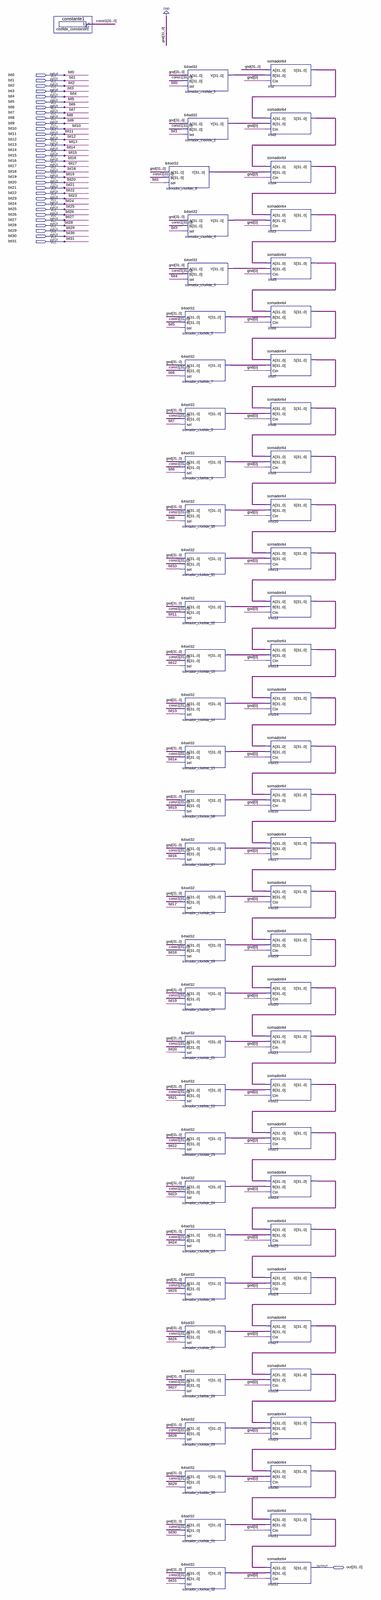
[diagram p0: schematic sheet, whole]
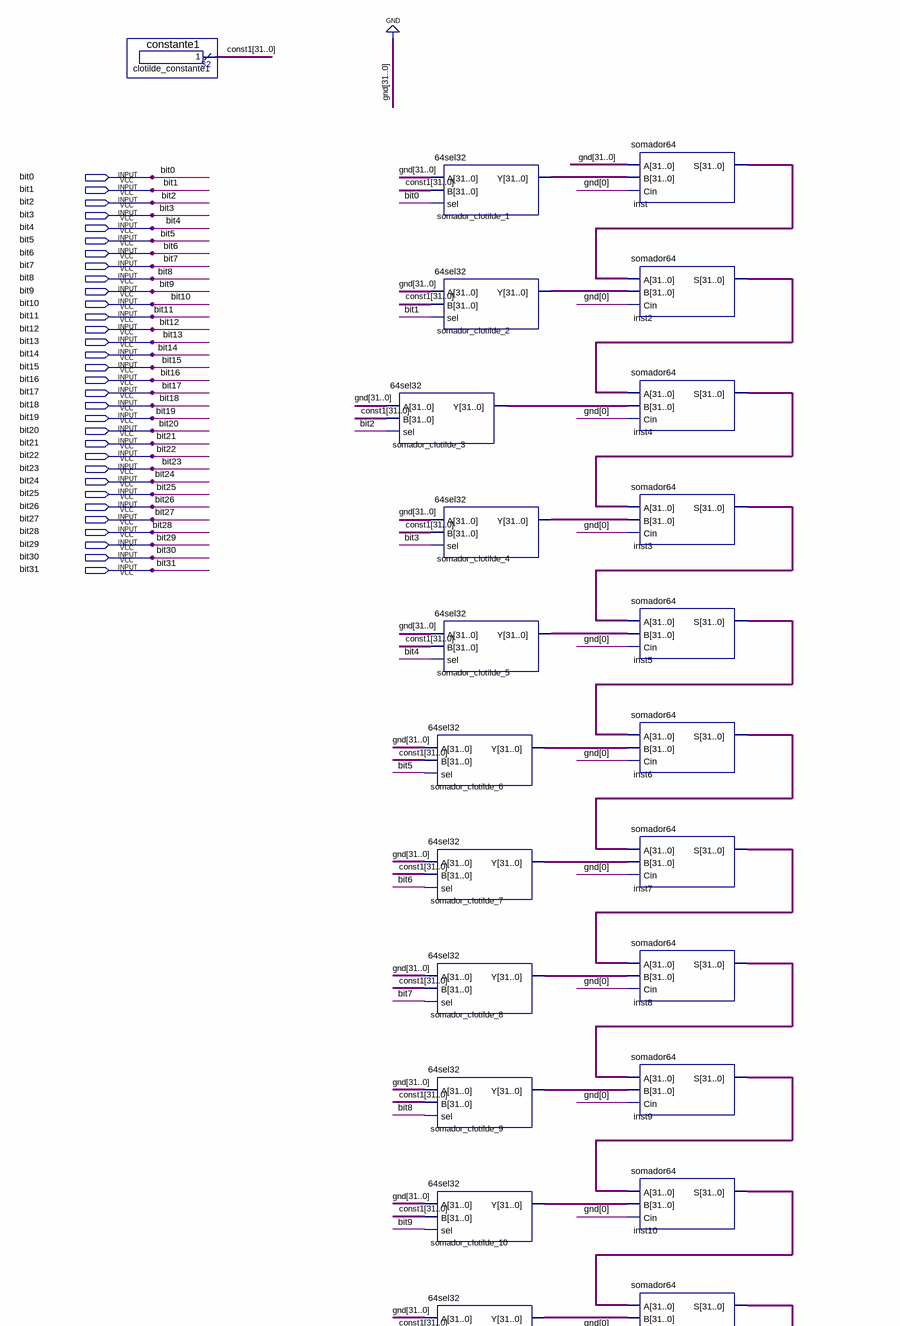
[diagram p1: schematic sheet, upper part]
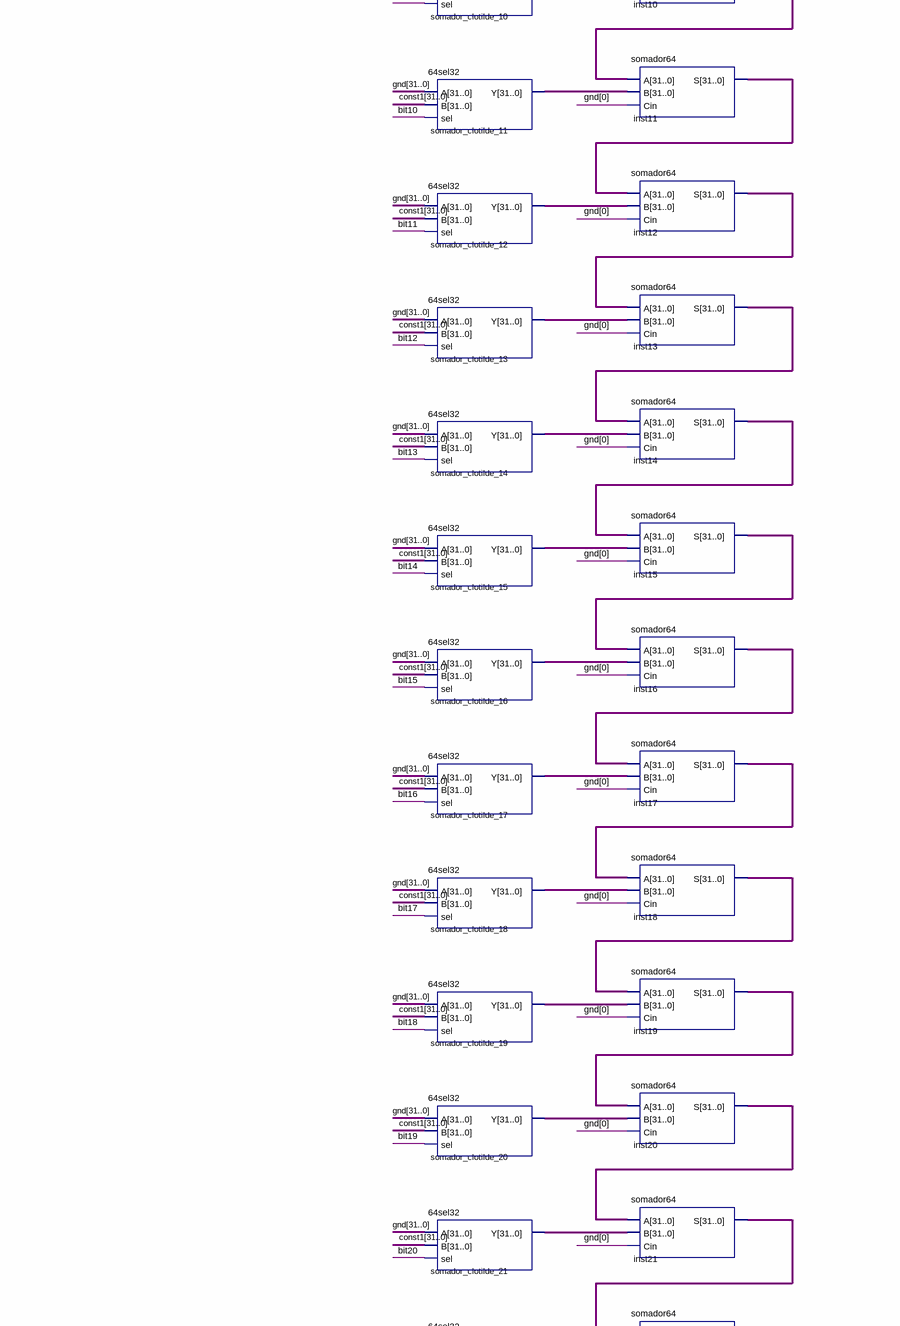
[diagram p2: schematic sheet, middle part]
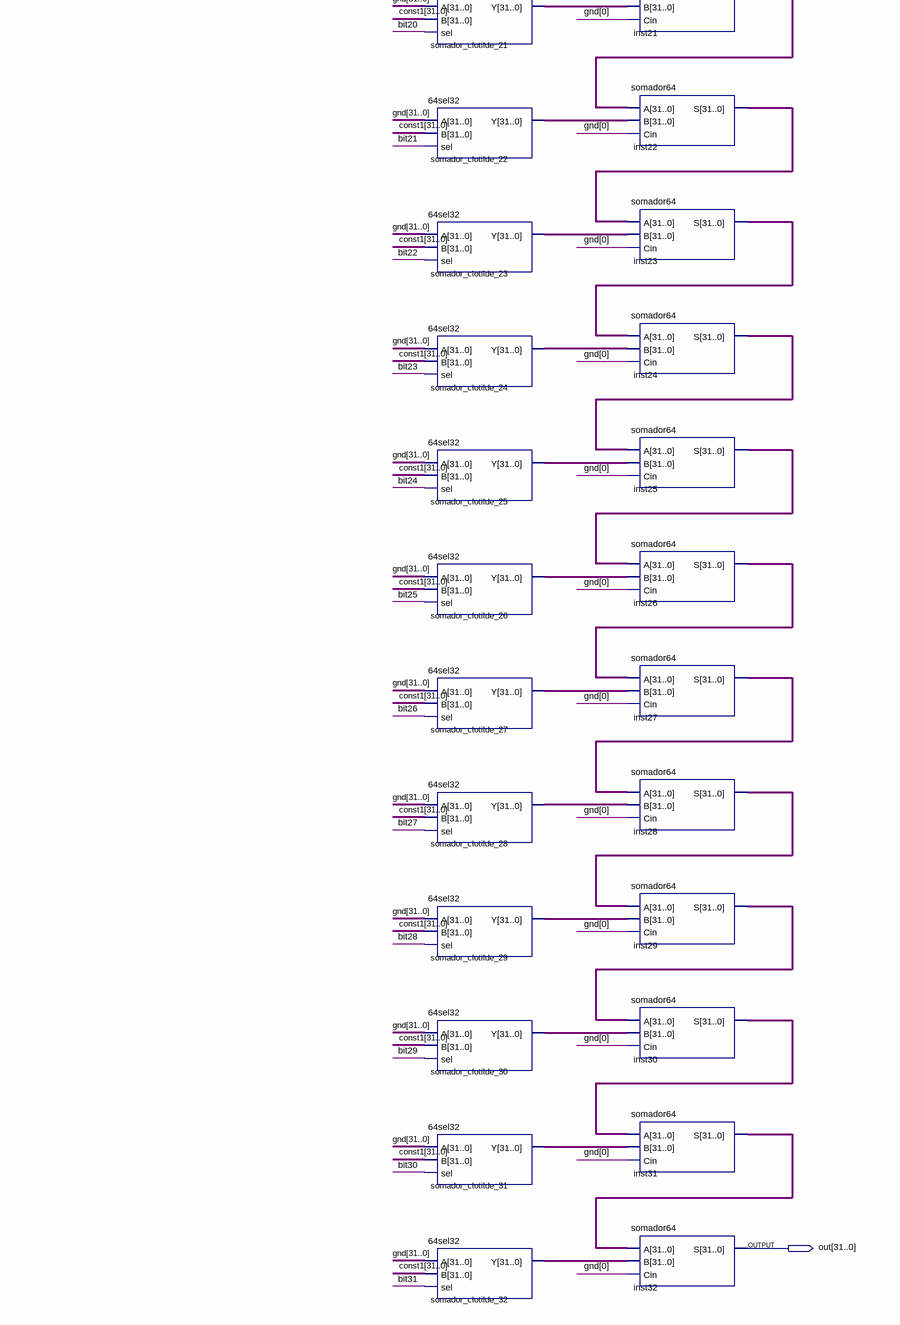
[diagram p3: schematic sheet, lower part]
// Quartus schematic somador_clotilde.bdf as structural Verilog: 65 symbols, 33 pins
module somador_clotilde (
  input  bit0,
  input  bit1,
  input  bit2,
  input  bit3,
  input  bit4,
  input  bit5,
  input  bit6,
  input  bit7,
  input  bit8,
  input  bit9,
  input  bit10,
  input  bit11,
  input  bit12,
  input  bit13,
  input  bit14,
  input  bit15,
  input  bit16,
  input  bit17,
  input  bit18,
  input  bit19,
  input  bit20,
  input  bit21,
  input  bit22,
  input  bit23,
  input  bit24,
  input  bit25,
  input  bit26,
  input  bit27,
  input  bit28,
  input  bit29,
  input  bit30,
  input  bit31,
  output [31:0] out
);

  wire [31:0] const1, inst2_s, inst3_s, inst4_s, inst5_s, inst6_s, inst7_s, inst8_s, inst9_s, inst10_s,
       inst11_s, inst12_s, inst13_s, inst14_s, inst15_s, inst16_s, inst17_s, inst18_s, inst19_s, inst20_s,
       inst21_s, inst22_s, inst23_s, inst24_s, inst25_s, inst26_s, inst27_s, inst28_s, inst29_s, inst30_s,
       inst31_s, inst_s, somador_clotilde_1_y, somador_clotilde_2_y, somador_clotilde_3_y,
       somador_clotilde_4_y, somador_clotilde_5_y, somador_clotilde_6_y, somador_clotilde_7_y,
       somador_clotilde_8_y, somador_clotilde_9_y, somador_clotilde_10_y, somador_clotilde_11_y,
       somador_clotilde_12_y, somador_clotilde_13_y, somador_clotilde_14_y, somador_clotilde_15_y,
       somador_clotilde_16_y, somador_clotilde_17_y, somador_clotilde_18_y, somador_clotilde_19_y,
       somador_clotilde_20_y, somador_clotilde_21_y, somador_clotilde_22_y, somador_clotilde_23_y,
       somador_clotilde_24_y, somador_clotilde_25_y, somador_clotilde_26_y, somador_clotilde_27_y,
       somador_clotilde_28_y, somador_clotilde_29_y, somador_clotilde_30_y, somador_clotilde_31_y,
       somador_clotilde_32_y;

  constante1 clotilde_constante1 (.result(const1));
  \64sel32  somador_clotilde_3 (.A({32{1'b0}}), .B(const1), .sel(bit2), .Y(somador_clotilde_3_y));
  \64sel32  somador_clotilde_6 (.A({32{1'b0}}), .B(const1), .sel(bit5), .Y(somador_clotilde_6_y));
  \64sel32  somador_clotilde_7 (.A({32{1'b0}}), .B(const1), .sel(bit6), .Y(somador_clotilde_7_y));
  \64sel32  somador_clotilde_8 (.A({32{1'b0}}), .B(const1), .sel(bit7), .Y(somador_clotilde_8_y));
  \64sel32  somador_clotilde_9 (.A({32{1'b0}}), .B(const1), .sel(bit8), .Y(somador_clotilde_9_y));
  \64sel32  somador_clotilde_10 (.A({32{1'b0}}), .B(const1), .sel(bit9), .Y(somador_clotilde_10_y));
  \64sel32  somador_clotilde_11 (.A({32{1'b0}}), .B(const1), .sel(bit10), .Y(somador_clotilde_11_y));
  \64sel32  somador_clotilde_12 (.A({32{1'b0}}), .B(const1), .sel(bit11), .Y(somador_clotilde_12_y));
  \64sel32  somador_clotilde_13 (.A({32{1'b0}}), .B(const1), .sel(bit12), .Y(somador_clotilde_13_y));
  \64sel32  somador_clotilde_14 (.A({32{1'b0}}), .B(const1), .sel(bit13), .Y(somador_clotilde_14_y));
  \64sel32  somador_clotilde_15 (.A({32{1'b0}}), .B(const1), .sel(bit14), .Y(somador_clotilde_15_y));
  \64sel32  somador_clotilde_16 (.A({32{1'b0}}), .B(const1), .sel(bit15), .Y(somador_clotilde_16_y));
  \64sel32  somador_clotilde_17 (.A({32{1'b0}}), .B(const1), .sel(bit16), .Y(somador_clotilde_17_y));
  \64sel32  somador_clotilde_18 (.A({32{1'b0}}), .B(const1), .sel(bit17), .Y(somador_clotilde_18_y));
  \64sel32  somador_clotilde_19 (.A({32{1'b0}}), .B(const1), .sel(bit18), .Y(somador_clotilde_19_y));
  \64sel32  somador_clotilde_20 (.A({32{1'b0}}), .B(const1), .sel(bit19), .Y(somador_clotilde_20_y));
  \64sel32  somador_clotilde_21 (.A({32{1'b0}}), .B(const1), .sel(bit20), .Y(somador_clotilde_21_y));
  \64sel32  somador_clotilde_22 (.A({32{1'b0}}), .B(const1), .sel(bit21), .Y(somador_clotilde_22_y));
  \64sel32  somador_clotilde_23 (.A({32{1'b0}}), .B(const1), .sel(bit22), .Y(somador_clotilde_23_y));
  \64sel32  somador_clotilde_24 (.A({32{1'b0}}), .B(const1), .sel(bit23), .Y(somador_clotilde_24_y));
  \64sel32  somador_clotilde_25 (.A({32{1'b0}}), .B(const1), .sel(bit24), .Y(somador_clotilde_25_y));
  \64sel32  somador_clotilde_26 (.A({32{1'b0}}), .B(const1), .sel(bit25), .Y(somador_clotilde_26_y));
  \64sel32  somador_clotilde_27 (.A({32{1'b0}}), .B(const1), .sel(bit26), .Y(somador_clotilde_27_y));
  \64sel32  somador_clotilde_28 (.A({32{1'b0}}), .B(const1), .sel(bit27), .Y(somador_clotilde_28_y));
  \64sel32  somador_clotilde_29 (.A({32{1'b0}}), .B(const1), .sel(bit28), .Y(somador_clotilde_29_y));
  \64sel32  somador_clotilde_30 (.A({32{1'b0}}), .B(const1), .sel(bit29), .Y(somador_clotilde_30_y));
  \64sel32  somador_clotilde_31 (.A({32{1'b0}}), .B(const1), .sel(bit30), .Y(somador_clotilde_31_y));
  \64sel32  somador_clotilde_32 (.A({32{1'b0}}), .B(const1), .sel(bit31), .Y(somador_clotilde_32_y));
  \64sel32  somador_clotilde_1 (.A({32{1'b0}}), .B(const1), .sel(bit0), .Y(somador_clotilde_1_y));
  \64sel32  somador_clotilde_2 (.A({32{1'b0}}), .B(const1), .sel(bit1), .Y(somador_clotilde_2_y));
  \64sel32  somador_clotilde_4 (.A({32{1'b0}}), .B(const1), .sel(bit3), .Y(somador_clotilde_4_y));
  \64sel32  somador_clotilde_5 (.A({32{1'b0}}), .B(const1), .sel(bit4), .Y(somador_clotilde_5_y));
  somador64 inst (.A({32{1'b0}}), .B(somador_clotilde_1_y), .Cin(1'b0), .S(inst_s));
  somador64 inst2 (.A(inst_s), .B(somador_clotilde_2_y), .Cin(1'b0), .S(inst2_s));
  somador64 inst4 (.A(inst2_s), .B(somador_clotilde_3_y), .Cin(1'b0), .S(inst4_s));
  somador64 inst3 (.A(inst4_s), .B(somador_clotilde_4_y), .Cin(1'b0), .S(inst3_s));
  somador64 inst5 (.A(inst3_s), .B(somador_clotilde_5_y), .Cin(1'b0), .S(inst5_s));
  somador64 inst6 (.A(inst5_s), .B(somador_clotilde_6_y), .Cin(1'b0), .S(inst6_s));
  somador64 inst7 (.A(inst6_s), .B(somador_clotilde_7_y), .Cin(1'b0), .S(inst7_s));
  somador64 inst8 (.A(inst7_s), .B(somador_clotilde_8_y), .Cin(1'b0), .S(inst8_s));
  somador64 inst9 (.A(inst8_s), .B(somador_clotilde_9_y), .Cin(1'b0), .S(inst9_s));
  somador64 inst10 (.A(inst9_s), .B(somador_clotilde_10_y), .Cin(1'b0), .S(inst10_s));
  somador64 inst11 (.A(inst10_s), .B(somador_clotilde_11_y), .Cin(1'b0), .S(inst11_s));
  somador64 inst12 (.A(inst11_s), .B(somador_clotilde_12_y), .Cin(1'b0), .S(inst12_s));
  somador64 inst13 (.A(inst12_s), .B(somador_clotilde_13_y), .Cin(1'b0), .S(inst13_s));
  somador64 inst14 (.A(inst13_s), .B(somador_clotilde_14_y), .Cin(1'b0), .S(inst14_s));
  somador64 inst15 (.A(inst14_s), .B(somador_clotilde_15_y), .Cin(1'b0), .S(inst15_s));
  somador64 inst16 (.A(inst15_s), .B(somador_clotilde_16_y), .Cin(1'b0), .S(inst16_s));
  somador64 inst17 (.A(inst16_s), .B(somador_clotilde_17_y), .Cin(1'b0), .S(inst17_s));
  somador64 inst18 (.A(inst17_s), .B(somador_clotilde_18_y), .Cin(1'b0), .S(inst18_s));
  somador64 inst19 (.A(inst18_s), .B(somador_clotilde_19_y), .Cin(1'b0), .S(inst19_s));
  somador64 inst20 (.A(inst19_s), .B(somador_clotilde_20_y), .Cin(1'b0), .S(inst20_s));
  somador64 inst21 (.A(inst20_s), .B(somador_clotilde_21_y), .Cin(1'b0), .S(inst21_s));
  somador64 inst22 (.A(inst21_s), .B(somador_clotilde_22_y), .Cin(1'b0), .S(inst22_s));
  somador64 inst23 (.A(inst22_s), .B(somador_clotilde_23_y), .Cin(1'b0), .S(inst23_s));
  somador64 inst24 (.A(inst23_s), .B(somador_clotilde_24_y), .Cin(1'b0), .S(inst24_s));
  somador64 inst25 (.A(inst24_s), .B(somador_clotilde_25_y), .Cin(1'b0), .S(inst25_s));
  somador64 inst26 (.A(inst25_s), .B(somador_clotilde_26_y), .Cin(1'b0), .S(inst26_s));
  somador64 inst27 (.A(inst26_s), .B(somador_clotilde_27_y), .Cin(1'b0), .S(inst27_s));
  somador64 inst28 (.A(inst27_s), .B(somador_clotilde_28_y), .Cin(1'b0), .S(inst28_s));
  somador64 inst29 (.A(inst28_s), .B(somador_clotilde_29_y), .Cin(1'b0), .S(inst29_s));
  somador64 inst30 (.A(inst29_s), .B(somador_clotilde_30_y), .Cin(1'b0), .S(inst30_s));
  somador64 inst31 (.A(inst30_s), .B(somador_clotilde_31_y), .Cin(1'b0), .S(inst31_s));
  somador64 inst32 (.A(inst31_s), .B(somador_clotilde_32_y), .Cin(1'b0), .S(out));
endmodule
